# Altium schematic sheet ESPC3_schematic.SchDoc
size A4; SheetNumber: 3; SheetTotal: 3
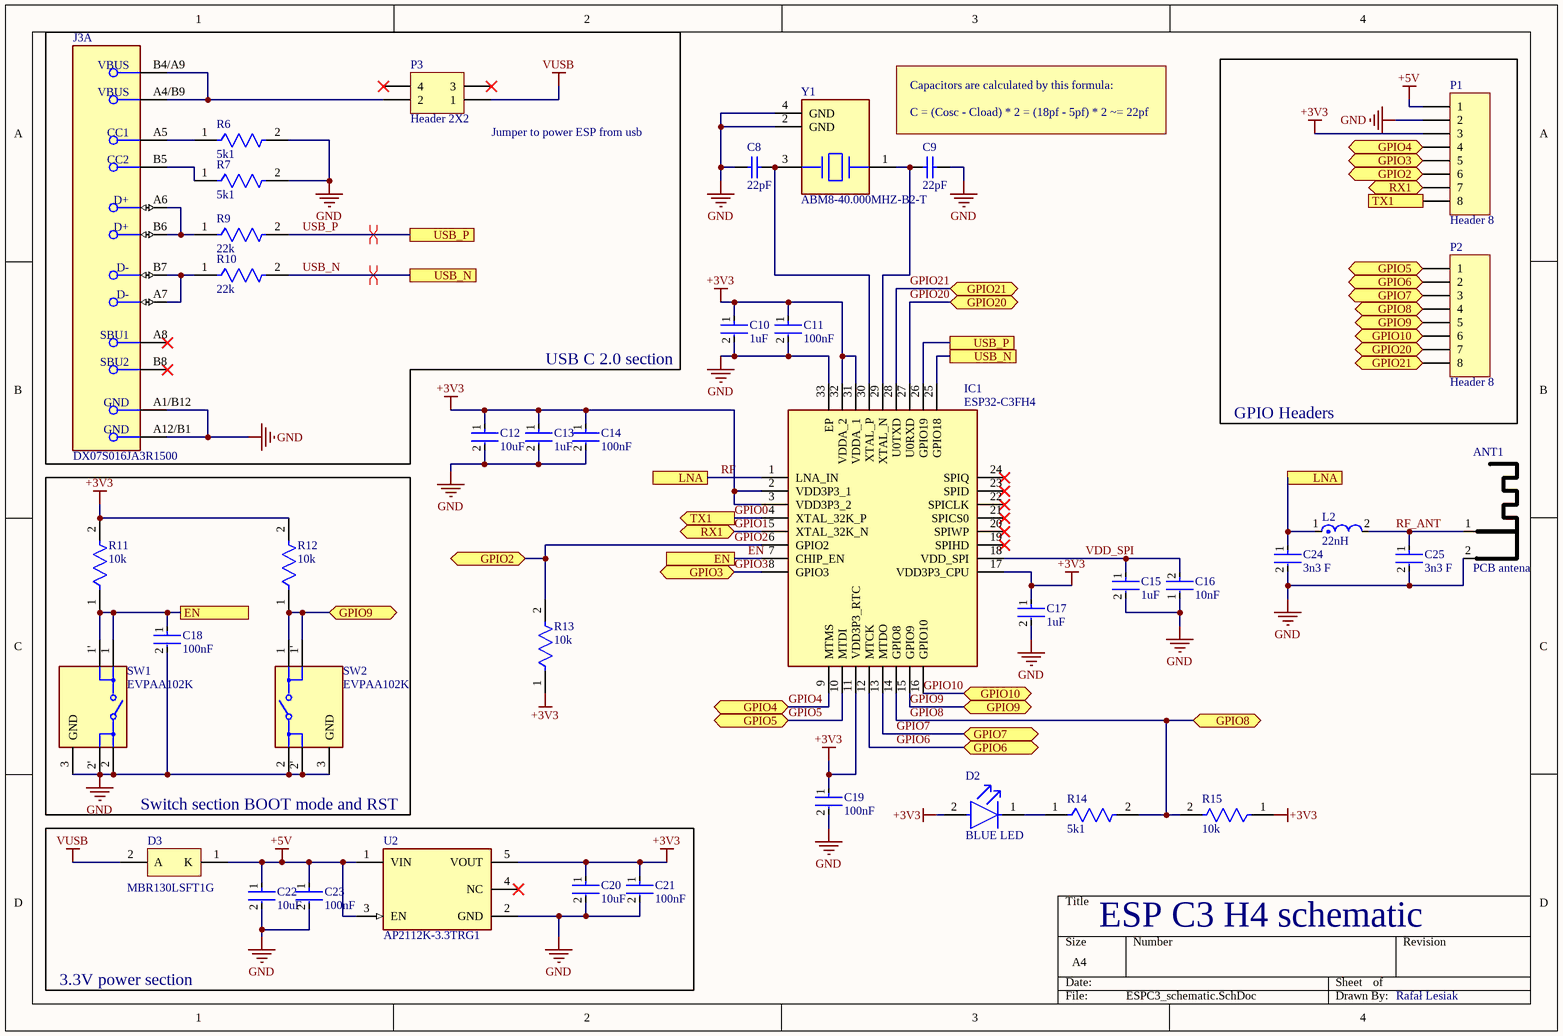
[diagram p0: ESPC3_schematic.SchDoc]

## Parts
ANT1  PCB antena  [ANT_PCB_2_4GHz]
C8  22pF  [CAPC0603X33X15LL03T05]
C9  22pF  [CAPC0603X33X15LL03T05]
C10  1uF  [FP-GRM033-0_05-e01_0_2-MFG]
C11  100nF  [FP-GRM033-0_03-MFG]
C12  10uF  [FP-GRM155-0_2-IPC_A]
C13  1uF  [FP-GRM033-0_05-e01_0_2-MFG]
C14  100nF  [FP-GRM033-0_03-MFG]
C15  1uF  [FP-GRM033-0_05-e01_0_2-MFG]
C16  10nF  [FP-GCM033-0_03-MFG]
C17  1uF  [FP-GRM033-0_05-e01_0_2-MFG]
C18  100nF  [FP-GRM033-0_03-MFG]
C19  100nF  [FP-GRM033-0_03-MFG]
C20  10uF  [FP-GRM155-0_2-IPC_A]
C21  100nF  [FP-GRM033-0_03-MFG]
C22  10uF  [FP-GRM155-0_2-IPC_A]
C23  100nF  [FP-GRM033-0_03-MFG]
C24  3n3 F  [FP-GRM022-0_02-IPC_C]
C25  3n3 F  [FP-GRM022-0_02-IPC_C]
D2  BLUE LED  [FP-LTST-C191TBKT-MFG]
D3  MBR130LSFT1G  [ONSC-SOD-123FL-2-498_V]
IC1  ESP32-C3FH4  [QFN50P500X500X90-33N-D]
J3  DX07S016JA3R1500  [FP-DX07S016JA3R1500-MFG]  (part A of 2)
L2  22nH  [FP-LQP03PN_02-MFG]
P1  Header 8  [HDR1X8]
P2  Header 8  [HDR1X8]
P3  Header 2X2  [HDR2X2]
R6  5k1  [FP-AF0201-IPC_C]
R7  5k1  [FP-AF0201-IPC_C]
R9  22k  [FP-RMCF0201-IPC_B]
R10  22k  [FP-RMCF0201-IPC_B]
R11  10k  [FP-AC0402-IPC_C]
R12  10k  [FP-AC0402-IPC_C]
R13  10k  [FP-AC0402-IPC_C]
R14  5k1  [FP-AF0201-IPC_C]
R15  10k  [FP-AC0402-IPC_C]
SW1  EVPAA102K  [FP-EVPAA102K-MFG]
SW2  EVPAA102K  [FP-EVPAA102K-MFG]
U2  AP2112K-3.3TRG1  [FP-SOT25-IPC_A]
Y1  ABM8-40.000MHZ-B2-T  [FP-ABM8-MFG]

## Blocks framed on the sheet
USB C 2.0 section: J3 P3 R6 R7 R9 R10
GPIO Headers: P1 P2
Switch section BOOT mode and RST: C18 R11 R12 SW1 SW2

## Ports
EN (see ESPC3_schematic[1C]), EN (see ESPC3_schematic[2C]), GPIO2 (bidir, see ESPC3_schematic[2C]), GPIO2 (bidir, see ESPC3_schematic[4A]), GPIO3 (bidir, see ESPC3_schematic[2C]), GPIO3 (bidir, see ESPC3_schematic[4A]), GPIO4 (bidir, see ESPC3_schematic[2C]), GPIO4 (bidir, see ESPC3_schematic[4A]), GPIO5 (bidir, see ESPC3_schematic[2C]), GPIO5 (bidir, see ESPC3_schematic[4B]), GPIO6 (bidir, see ESPC3_schematic[3C]), GPIO6 (bidir, see ESPC3_schematic[4B]), GPIO7 (bidir, see ESPC3_schematic[3C]), GPIO7 (bidir, see ESPC3_schematic[4B]), GPIO8 (bidir, see ESPC3_schematic[4B]), GPIO8 (bidir, see ESPC3_schematic[4C]), GPIO9 (bidir, see ESPC3_schematic[1C], ESPC3_schematic[3C]), GPIO9 (bidir, see ESPC3_schematic[1C], ESPC3_schematic[4B]), GPIO9 (bidir, see ESPC3_schematic[3C], ESPC3_schematic[4B]), GPIO10 (bidir, see ESPC3_schematic[3C]), GPIO10 (bidir, see ESPC3_schematic[4B]), GPIO20 (bidir, see ESPC3_schematic[3B]), GPIO20 (bidir, see ESPC3_schematic[4B]), GPIO21 (bidir, see ESPC3_schematic[3B]), GPIO21 (bidir, see ESPC3_schematic[4B]), LNA (see ESPC3_schematic[2B]), LNA (see ESPC3_schematic[4B]), RX1 (bidir, see ESPC3_schematic[2C], Rasberry_pi_connections[3B]), RX1 (bidir, see ESPC3_schematic[4A], Rasberry_pi_connections[3B]), TX1 (out, see ESPC3_schematic[2C], Rasberry_pi_connections[2B]), TX1 (out, see ESPC3_schematic[4A], Rasberry_pi_connections[2B]), USB_N (see ESPC3_schematic[2B]), USB_N (see ESPC3_schematic[3B]), USB_P (see ESPC3_schematic[2A]), USB_P (see ESPC3_schematic[3B])

## Nets
+3V3: C10.1 C11.1 C12.1 C13.1 C14.1 C17.1 C19.1 C20.1 C21.1 D2.2(A) IC1.2(VDD3P3_1) IC1.3(VDD3P3_2) IC1.11(VDD3P3_RTC) IC1.17(VDD3P3_CPU) IC1.31(VDDA_1) IC1.32(VDDA_2) P1.3 R11.2 R12.2 R13.1 R15.1 U2.5(VOUT)
+5V: C22.1 C23.1 D3.1(K) P1.1 U2.1(VIN) U2.3(EN)
GND: ANT1.2(GND) C8.1 C9.2 C10.2 C11.2 C12.2 C13.2 C14.2 C15.2 C16.1 C17.2 C18.2 C19.2 C20.2 C21.2 C22.2 C23.2 C24.2 C25.2 IC1.33(EP) J3.A1/B12(GND) J3.A12/B1(GND) P1.2 R6.2 R7.2 SW1.2 SW1.2' SW1.3(GND) SW2.2 SW2.2' SW2.3(GND) U2.2(GND) Y1.2(GND) Y1.4(GND)
VUSB: D3.2(A) P3.1
EN: C18.1 IC1.7(CHIP_EN) R11.1 SW1.1 SW1.1' ; port EN
GPIO0: IC1.4(XTAL_32K_P) P1.8 ; port TX1
GPIO1: IC1.5(XTAL_32K_N) P1.7 ; port RX1
GPIO2: IC1.6(GPIO2) P1.6 R13.2 ; port GPIO2
GPIO3: IC1.8(GPIO3) P1.5 ; port GPIO3
GPIO4: IC1.9(MTMS) P1.4 ; port GPIO4
GPIO5: IC1.10(MTDI) P2.1 ; port GPIO5
GPIO6: IC1.12(MTCK) P2.2 ; port GPIO6
GPIO7: IC1.13(MTDO) P2.3 ; port GPIO7
GPIO8: IC1.14(GPIO8) P2.4 R14.2 R15.2 ; port GPIO8
GPIO9: IC1.15(GPIO9) P2.5 R12.1 SW2.1 SW2.1' ; port GPIO9
GPIO10: IC1.16(GPIO10) P2.6 ; port GPIO10
GPIO20: IC1.27(U0RXD) P2.7 ; port GPIO20
GPIO21: IC1.28(U0TXD) P2.8 ; port GPIO21
RF: C24.1 IC1.1(LNA_IN) L2.1 ; port LNA
RF_ANT: ANT1.1(RF) C25.1 L2.2
USB_N: IC1.25(GPIO18) R10.2 ; port USB_N
USB_P: IC1.26(GPIO19) R9.2 ; port USB_P
VDD_SPI: C15.1 C16.2 IC1.18(VDD_SPI)
NetC8_2: C8.2 IC1.30(XTAL_P) Y1.3
NetC9_1: C9.1 IC1.29(XTAL_N) Y1.1
NetD2_1: D2.1(C) R14.1
NetJ3_A4/B9: J3.A4/B9(VBUS) J3.B4/A9(VBUS) P3.2
NetJ3_A5: J3.A5(CC1) R6.1
NetJ3_A6: J3.A6(D+) J3.B6(D+) R9.1
NetJ3_A7: J3.A7(D-) J3.B7(D-) R10.1
NetJ3_B5: J3.B5(CC2) R7.1

Not connected (* = marked no-connect by the designer): IC1 19(SPIHD)* 20(SPIWP)* 21(SPICS0)* 22(SPICLK)* 23(SPID)* 24(SPIQ)*; J3 A8(SBU1)* B8(SBU2)*; P3 3* 4*; U2 4(NC)*

## Layout directives
differential pair: USB_N, USB_P

## Notes on the sheet
- (near Y1) Capacitors are calculated by this formula:
- C = (Cosc - Cload) * 2 = (18pf - 5pf) * 2 ~= 22pf
- (near P3) Jumper to power ESP from usb
- 3.3V power section
- ESP C3 H4 schematic
- Rafał Lesiak

## Library data of the parts
ANT1 = ANT_PCB_2.4GHz: PCB antena 2.4GHz 50ohm from AN043 texas instrument; ComponentLink1Description: Aplication note; ComponentLink1URL: https://www.ti.com/lit/an/swra117d/swra117d.pdf
C8 C9 = CMP-2010-00172-1: Manufacturer: AVX Interconnect / Elco; Part Number: 0201YA220JAT2A
C10 C13 C15 C17 = CMP-06035-050598-1: Chip Multilayer Ceramic Capacitors for General Purpose, 0201, 1.0uF, X5R, 15%, 20%, 10V
C11 C14 C18 C19 C21 C23 = CMP-06035-019237-1: Chip Multilayer Ceramic Capacitors for General Purpose, 0201, 0.10uF, X7S, 22%, 10%, 10V; Voltage Rating (DC): 10V; Width: 300um; Tolerance: 10%; Thickness: 300um; Capacitance: 100nF; Dielectric: X7S; Length: 600um
C12 C20 C22 = CMP-06035-026070-1: Chip Multilayer Ceramic Capacitors for General Purpose, 0402, 10uF, X5R, 15%, 20%, 10V
C16 = CMP-06035-038894-1: Ceramic Capacitor for Automotive 10nF  ±10% 10VDC X7R 0201 Paper T/R; Voltage Rating (DC): 10V; Case/Package: Ceramic; Capacitance: 10nF; Dielectric: X7R; Tolerance: 10%
C24 C25 = CMP-06035-053620-1: Chip Multilayer Ceramic Capacitors for General Purpose, 01005, 3.3pF, C0G, 30ppm/°C, 0.25pF, 16V
D2 = CMP-22017-000008-1: LED BLUE CLEAR CHIP SMD; Lens Color: Colorless; Dominant Wavelength: 475nm; Forward Current: 20mA; Wavelength: 468nm; Viewing Angle: 130°; Power Dissipation: 76mW; Luminous Intensity: 180mcd; Reverse Voltage: 5V; Number of Elements: 1; Lens Style: Diffused; Forward Voltage: 3.8V; Max Power Dissipation: 75mW; Case Code (Metric): 1608; Packaging: Tape and Reel; Case/Package: 0603; Depth: 1.6mm; Mount: Surface Mount; Lead Free: Lead Free; Min Operating Temperature: -20°C; Lens Transparency: Clear; Illumination Color: Blue; Height: 0.55mm; Test Current: 20mA; Case Code (Imperial): 0603; Max Operating Temperature: 80°C; Number of Pins: 2; Length: 0.8mm; Radiation Hardening: No; Package Quantity: 1; Number of LEDs: 1; Width: 0.8mm; Color: Blue
D3 = CMP-1055-00430-1: Schottky Power Rectifier, 2-Pin SOD-123, Pb-Free, Tape and Reel; Manufacturer: On Semiconductor; Configuration: Single; IFSM Max (A): 40; Packing: Tape and Reel; ComponentLink1URL: http://www.onsemi.com/; Mounting Technology: Surface Mount; ComponentLink1Description: Manufacturer URL; PartNumber: MBR130LSFT1G; PackageDescription: 2-Pin SOD, Body 1.65 x 2.7 mm; ComponentLink3URL: http://www.onsemi.com/pub_link/Collateral/498-01.PDF; ComponentLink2URL: http://www.onsemi.cn/pub_link/Collateral/MBR130LSFT1-D.PDF; PackageVersion: Rev. D, 05/2013; RoHS: TRUE; DatasheetVersion: Rev. 3; PackageReference: SOD-123FL-2-498; ComponentLink3Description: Package Specification; ComponentLink2Description: Datasheet
IC1 = ESP32-C3FH4: Integrated Circuit; Manufacturer_Name: Espressif Systems; Datasheet Link: https://www.espressif.com/sites/default/files/documentation/esp32-c3_datasheet_en.pdf; Height: 0.9mm; Manufacturer_Part_Number: ESP32-C3FH4; Mouser Part Number: 356-ESP32-C3FH4; Mouser Price/Stock: https://www.mouser.co.uk/ProductDetail/Espressif-Systems/ESP32-C3FH4?qs=iLbezkQI%252BsgL5PSvEueYlQ%3D%3D
J3 = CMP-19038-000002-1: CONN RCP USB2.0 TYP C 24P SMD RA
L2 = CMP-06042-000709-1: Film type RF Inductor 22nH ±5% 140mA 2.85Ω 0201 (0603); Q Factor: 9; Core Material: Ferrite; Shielding: Unshielded; Self Resonant Frequency: 2.5GHz; DC Resistance (DCR): 2.85R; Test Frequency: 500MHz; Width: 0.012inch; Tolerance: 5%; Packaging: Tape and Reel; Inductance: 22nH; Military Standard: Not; Max DC Current: 140mA; Termination: SMD/SMT; Length: 0.024inch; Depth: 0.33mm; Max Operating Temperature: 125°C; Current Rating: 140mA; Mount: Surface Mount; Resistor Type: Thin Film; Case/Package: 0201; Height: 0.85mm; Weight: 6E-06oz; Height - Seated (Max): 0.013inch; Package Quantity: 15000; Case Code (Imperial): 0201; Min Operating Temperature: -55°C; DC Current: 140mA; Case Code (Metric): 0603
P1 P2 = Header 8: Header, 8-Pin; LatestRevisionDate: 17-Jul-2002; LatestRevisionNote: Re-released for DXP Platform.; Publisher: Altium Limited
P3 = Header 2X2: Header, 2-Pin, Dual row; LatestRevisionDate: 17-Jul-2002; LatestRevisionNote: Re-released for DXP Platform.; Publisher: Altium Limited
R6 R7 R14 = CMP-03412-047927-1: Anti-Sulfurated Chip Resistors Automotive Grade 5.1kΩ 1% 200ppm/°C 0201; Resistance: 5.1kR; Max Power Dissipation: 50mW; Packaging: Tape and Reel; Features: Moisture Resistant; Height: 0.01inch; Length: 0.024inch; Min Operating Temperature: -55°C; RoHS Compliant: Yes; Max Operating Temperature: 125°C; Width: 0.012inch; Resistor Type: Thick Film; Tolerance: 1%; Series: AF; Number of Terminations: 2; Case/Package: 0201; Temperature Coefficient: 200ppm/°C
R9 R10 = CMP-26527-001675-1: 22kΩ ±5% 0.05W 0201 Thick Film Chip Resistor AEC-Q200 compliant; Resistance: 22kR; Temperature Coefficient: 200ppm/°C; Max Power Dissipation: 50mW; Height: 0.009inch; Radiation Hardening: No; RoHS Compliant: Yes; Number of Terminations: 2; Max Operating Temperature: 125°C; Length: 0.024inch; Resistor Type: Thick Film; Case/Package: 0201; Case Code (Metric): 0603; Case Code (Imperial): 0201; Width: 0.012inch; Tolerance: 5%; Contact Plating: Tin; Mount: Surface Mount; Series: RMCF; Min Operating Temperature: -55°C; Packaging: Tape and Reel
R11-R13 R15 = CMP-03412-044365-1: RES 10kΩ ±1% 0.125W 0402; RoHS Compliant: Yes
SW1 SW2 = CMP-00287-20843803-1: EVPAA102K Switch Tactile N.O. SPST Rectangular Button J-Bend 0.02A 15VDC 1N SMD Embossed T/R; Life (Cycles): 1Mcycles; Contact Current Rating: 20mA; Number of Positions: 2; Voltage Rating (DC): 12V; Switch Travel: 150µm; Switch Function: Off-Mom; Max Voltage Rating (DC): 15V; Contact Resistance: 100mΩ; Illumination Type: Non-Illuminated; Actuator Length: 300µm; Current Rating: 50mA; Lead Free: Lead Free; Color: Black; RoHS: Compliant; Contact Plating: Silver; Height: 700µm; Min Operating Temperature: -40°C; Orientation: Straight; Length: 4.3mm; Throw Configuration: SPST; Mount: Surface Mount; Radiation Hardening: No; Electrical Life: 1Mcycles; Mechanical Life: 1Mcycles; Operating Force: 1N; Case/Package: SMD/SMT; Max Operating Temperature: 85°C; Termination: J-Bend; Depth: 2.9mm; NexarPartId: 20843803; Max Current Rating: 20mA
U2 = CMP-12756-000035-1: IC REG LINEAR 3.3V 600MA SOT25; Number of Regulators: 1; Output Type: Fixed; Polarity: Positive; Min Input Voltage: 2.5V; Max Input Voltage: 6V; Accuracy: 1.5%; Quiescent Current: 55uA; Dropout Voltage: 250mV; Min Operating Temperature: -40°C; Length: 3.1mm; Output Current: 600mA; Max Operating Temperature: 85°C; Package Quantity: 1; Output Voltage: 3.3V; Width: 1.7mm; Number of Outputs: 1; Packaging: Tape and Reel; Height: 1.3mm; Lead Free: Lead Free; Max Output Current: 600mA; Case/Package: SOT-23-5; Mount: Surface Mount; Number of Pins: 5
Y1 = CMP-27762-005193-1: Crystal 40MHz ±20ppm 18pF SMD-4 3.2mm x 2.5mm; ESR (Equivalent Series Resistance): 35R; Frequency Stability: 50ppm; Radiation Hardening: No; Operating Frequency: 40 MHz; Frequency Tolerance: 20ppm; Lead Free: Lead Free; Load Capacitance: 18pF; Package Quantity: 1000; Width: 0.098inch; Series Resistance: 35R; Frequency: 40MHz; Height: 0.031inch; Depth: 2.5mm; Tolerance: 20ppm; Number of Pins: 4; Max Operating Temperature: 70°C; Termination: SMD/SMT; Packaging: Tape and Reel; Resistor Type: Ceramic; Length: 3.2mm; Mount: Surface Mount; Case/Package: SMD/SMT; Min Operating Temperature: -20°C; Series: ABM8